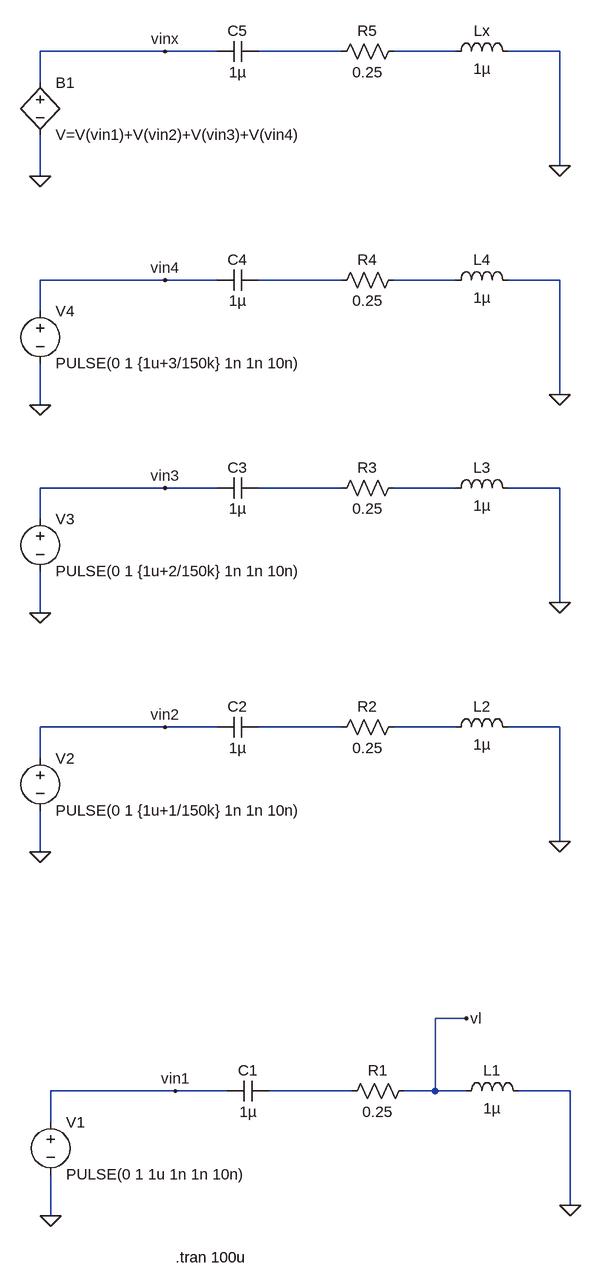
[diagram p0: schematic convolution_example.asc]
convolution_example.asc, the LTspice schematic file:
Version 4
SHEET 1 2176 1016
WIRE 32 -1120 -160 -1120
WIRE 112 -1120 32 -1120
WIRE 304 -1120 176 -1120
WIRE 480 -1120 384 -1120
WIRE 640 -1120 560 -1120
WIRE -160 -1072 -160 -1120
WIRE 640 -944 640 -1120
WIRE -160 -928 -160 -992
WIRE 32 -768 -160 -768
WIRE 112 -768 32 -768
WIRE 304 -768 176 -768
WIRE 480 -768 384 -768
WIRE 640 -768 560 -768
WIRE -160 -720 -160 -768
WIRE 640 -592 640 -768
WIRE -160 -576 -160 -640
WIRE 32 -448 -160 -448
WIRE 112 -448 32 -448
WIRE 304 -448 176 -448
WIRE 480 -448 384 -448
WIRE 640 -448 560 -448
WIRE -160 -400 -160 -448
WIRE 640 -272 640 -448
WIRE -160 -256 -160 -320
WIRE 32 -80 -160 -80
WIRE 112 -80 32 -80
WIRE 304 -80 176 -80
WIRE 480 -80 384 -80
WIRE 640 -80 560 -80
WIRE -160 -32 -160 -80
WIRE 640 96 640 -80
WIRE -160 112 -160 48
WIRE 496 368 448 368
WIRE 48 480 -144 480
WIRE 128 480 48 480
WIRE 320 480 192 480
WIRE 448 480 448 368
WIRE 448 480 400 480
WIRE 496 480 448 480
WIRE 656 480 576 480
WIRE -144 528 -144 480
WIRE 656 656 656 480
WIRE -144 672 -144 608
FLAG 656 656 0
FLAG 496 368 vl
FLAG 48 480 vin1
FLAG -144 672 0
FLAG 640 96 0
FLAG 32 -80 vin2
FLAG -160 112 0
FLAG 640 -272 0
FLAG 32 -448 vin3
FLAG -160 -256 0
FLAG 640 -592 0
FLAG 32 -768 vin4
FLAG -160 -576 0
FLAG 640 -944 0
FLAG 32 -1120 vinx
FLAG -160 -928 0
SYMBOL res 304 496 R270
WINDOW 0 32 56 VTop 2
WINDOW 3 0 56 VBottom 2
SYMATTR InstName R1
SYMATTR Value 0.25
SYMBOL ind 480 496 R270
WINDOW 0 32 56 VTop 2
WINDOW 3 5 56 VBottom 2
SYMATTR InstName L1
SYMATTR Value 1µ
SYMBOL cap 128 496 R270
WINDOW 0 32 32 VTop 2
WINDOW 3 0 32 VBottom 2
SYMATTR InstName C1
SYMATTR Value 1µ
SYMBOL voltage -144 512 R0
WINDOW 123 0 0 Left 0
WINDOW 39 0 0 Left 0
SYMATTR InstName V1
SYMATTR Value PULSE(0 1 1u 1n 1n 10n)
SYMBOL res 288 -64 R270
WINDOW 0 32 56 VTop 2
WINDOW 3 0 56 VBottom 2
SYMATTR InstName R2
SYMATTR Value 0.25
SYMBOL ind 464 -64 R270
WINDOW 0 32 56 VTop 2
WINDOW 3 5 56 VBottom 2
SYMATTR InstName L2
SYMATTR Value 1µ
SYMBOL cap 112 -64 R270
WINDOW 0 32 32 VTop 2
WINDOW 3 0 32 VBottom 2
SYMATTR InstName C2
SYMATTR Value 1µ
SYMBOL voltage -160 -48 R0
WINDOW 123 0 0 Left 0
WINDOW 39 0 0 Left 0
SYMATTR InstName V2
SYMATTR Value PULSE(0 1 {1u+1/150k} 1n 1n 10n)
SYMBOL res 288 -432 R270
WINDOW 0 32 56 VTop 2
WINDOW 3 0 56 VBottom 2
SYMATTR InstName R3
SYMATTR Value 0.25
SYMBOL ind 464 -432 R270
WINDOW 0 32 56 VTop 2
WINDOW 3 5 56 VBottom 2
SYMATTR InstName L3
SYMATTR Value 1µ
SYMBOL cap 112 -432 R270
WINDOW 0 32 32 VTop 2
WINDOW 3 0 32 VBottom 2
SYMATTR InstName C3
SYMATTR Value 1µ
SYMBOL voltage -160 -416 R0
WINDOW 123 0 0 Left 0
WINDOW 39 0 0 Left 0
SYMATTR InstName V3
SYMATTR Value PULSE(0 1 {1u+2/150k} 1n 1n 10n)
SYMBOL res 288 -752 R270
WINDOW 0 32 56 VTop 2
WINDOW 3 0 56 VBottom 2
SYMATTR InstName R4
SYMATTR Value 0.25
SYMBOL ind 464 -752 R270
WINDOW 0 32 56 VTop 2
WINDOW 3 5 56 VBottom 2
SYMATTR InstName L4
SYMATTR Value 1µ
SYMBOL cap 112 -752 R270
WINDOW 0 32 32 VTop 2
WINDOW 3 0 32 VBottom 2
SYMATTR InstName C4
SYMATTR Value 1µ
SYMBOL voltage -160 -736 R0
WINDOW 123 0 0 Left 0
WINDOW 39 0 0 Left 0
SYMATTR InstName V4
SYMATTR Value PULSE(0 1 {1u+3/150k} 1n 1n 10n)
SYMBOL res 288 -1104 R270
WINDOW 0 32 56 VTop 2
WINDOW 3 0 56 VBottom 2
SYMATTR InstName R5
SYMATTR Value 0.25
SYMBOL ind 464 -1104 R270
WINDOW 0 32 56 VTop 2
WINDOW 3 5 56 VBottom 2
SYMATTR InstName Lx
SYMATTR Value 1µ
SYMBOL cap 112 -1104 R270
WINDOW 0 32 32 VTop 2
WINDOW 3 0 32 VBottom 2
SYMATTR InstName C5
SYMATTR Value 1µ
SYMBOL bv -160 -1088 R0
SYMATTR InstName B1
SYMATTR Value V=V(vin1)+V(vin2)+V(vin3)+V(vin4)
TEXT 48 736 Left 2 !.tran 100u

The netlist it stands for:
* convolution_example.asc
R1 N009 vl 0.25
L1 vl 0 1µ
C1 vin1 N009 1µ
V1 vin1 0 PULSE(0 1 1u 1n 1n 10n)
R2 N007 N008 0.25
L2 N008 0 1µ
C2 vin2 N007 1µ
V2 vin2 0 PULSE(0 1 {1u+1/150k} 1n 1n 10n)
R3 N005 N006 0.25
L3 N006 0 1µ
C3 vin3 N005 1µ
V3 vin3 0 PULSE(0 1 {1u+2/150k} 1n 1n 10n)
R4 N003 N004 0.25
L4 N004 0 1µ
C4 vin4 N003 1µ
V4 vin4 0 PULSE(0 1 {1u+3/150k} 1n 1n 10n)
R5 N001 N002 0.25
Lx N002 0 1µ
C5 vinx N001 1µ
B1 vinx 0 V=V(vin1)+V(vin2)+V(vin3)+V(vin4)
.tran 100u
.backanno
.end